# EAGLE design Split-ADA4304-4 (EAGLE 7.5.0)

## Sheet 1 of 2
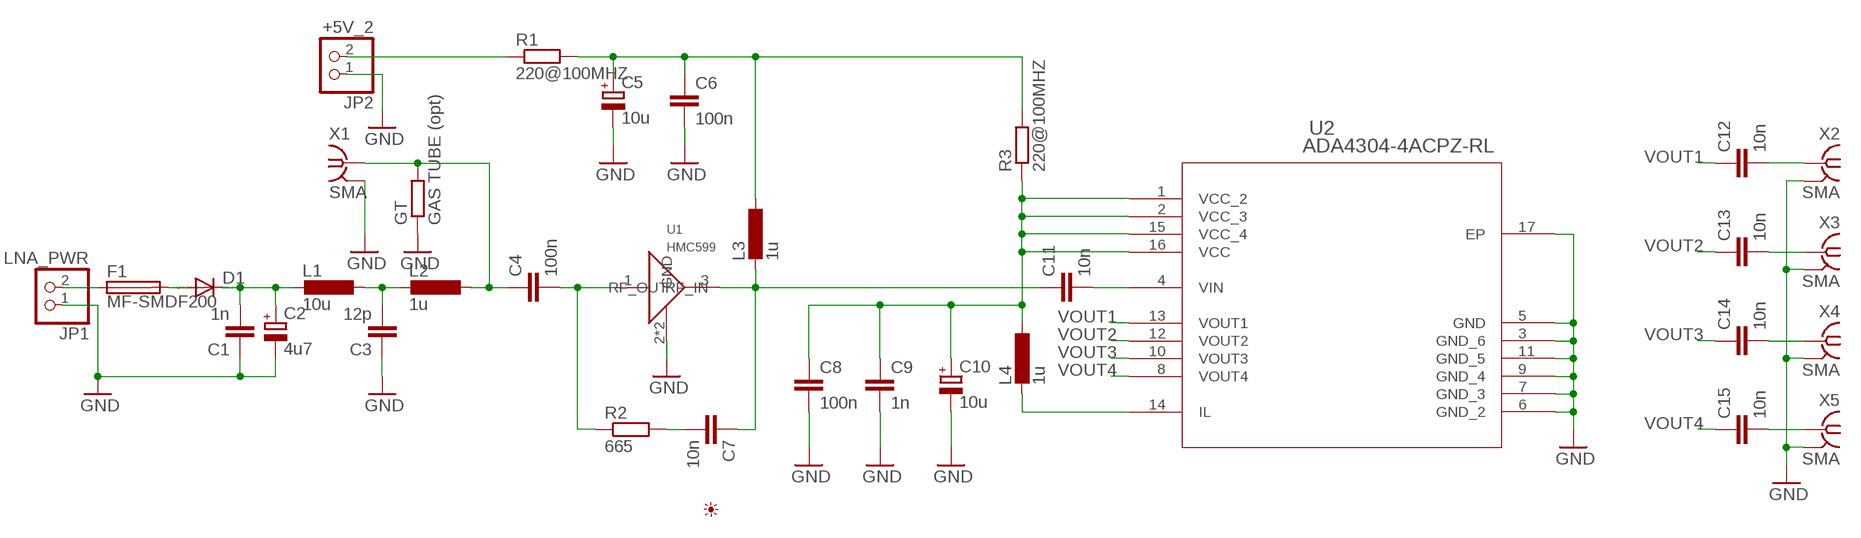
[diagram p0: schematic, sheet 1]

### Parts
C1  1n  C-EUC0603  [C0603]
C2  4u7  CPOL-EUSMCA  [SMC_A]
C3  12p  C-EUC0603  [C0603]
C4  100n  C-EUC0603  [C0603]
C5  10u  CPOL-EUSMCA  [SMC_A]
C6  100n  C-EUC0603  [C0603]
C7  10n  C-EUC0603  [C0603]
C8  100n  C-EUC0603  [C0603]
C9  1n  C-EUC0603  [C0603]
C10  10u  CPOL-EUSMCA  [SMC_A]
C11  10n  C-EUC0603  [C0603]
C12  10n  C-EUC0603  [C0603]
C13  10n  C-EUC0603  [C0603]
C14  10n  C-EUC0603  [C0603]
C15  10n  C-EUC0603  [C0603]
D1  DIODE-MINIMELF  [MINIMELF]
F1  MF-SMDF200  [MF-SMDF050]
GT  GAS TUBE (opt)  R-EU_R0805  [R0805]
JP1  LNA_PWR  PINHD-1X2  [1X02]
JP2  +5V_2  PINHD-1X2  [1X02]
L1  10u  L-EUL2012C  [L2012C]
L2  1u  L-EUL2012C  [L2012C]
L3  1u  L-EUL2012C  [L2012C]
L4  1u  L-EUL2012C  [L2012C]
PICTO1  PICTO_1  [PICTO_1]
R1  220@100MHZ  R-EU_R0805  [R0805]
R2  665  R-EU_R0603  [R0603]
R3  220@100MHZ  R-EU_R0805  [R0805]
U1  HMC599  [SOT89]
U2  ADA4304-4ACPZ-RL  [CP_16_2]
X1  SMA  SMA-142-0701-801/806  [J502-ND-142-0701-801/806]
X2  SMA  SMA-142-0701-801/806  [J502-ND-142-0701-801/806]
X3  SMA  SMA-142-0701-801/806  [J502-ND-142-0701-801/806]
X4  SMA  SMA-142-0701-801/806  [J502-ND-142-0701-801/806]
X5  SMA  SMA-142-0701-801/806  [J502-ND-142-0701-801/806]

### Nets
GND: C1.1 C2.- C3.1 C5.- C6.2 C8.2 C9.2 C10.- GT.1 JP1.1 JP2.1 U1.2(GND) U1.2.1(GND) U2.3(GND_6) U2.5(GND) U2.6(GND_2) U2.7(GND_3) U2.9(GND_4) U2.11(GND_5) U2.17(EP) X1.G@1 X1.G@2 X1.G@3 X1.G@4 X2.G@1 X2.G@2 X2.G@3 X2.G@4 X3.G@1 X3.G@2 X3.G@3 X3.G@4 X4.G@1 X4.G@2 X4.G@3 X4.G@4 X5.G@1 X5.G@2 X5.G@3 X5.G@4 ; also sheet 2
N$1: C8.1 C9.1 C10.+ L4.1 R3.1 U2.1(VCC_2) U2.2(VCC_3) U2.15(VCC_4) U2.16(VCC)
N$2: F1.1 JP1.2
N$3: C12.2 X2.1
N$4: C13.2 X3.1
N$5: C14.2 X4.1
N$6: C4.1 GT.2 L2.1 X1.1
N$7: C11.2 U2.4(VIN)
N$8: L4.2 U2.14(IL)
N$9: C15.2 X5.1
N$17: C5.+ C6.1 L3.1 R1.2 R3.2
N$22: C4.2 R2.1 U1.1(RF_IN)
N$23: JP2.2 R1.1
N$35: C1.2 C2.+ D1.C L1.2
N$41: C3.2 L1.1 L2.2
N$42: D1.A F1.2
N$51: C7.2 R2.2
RF_OUT: C7.1 C11.1 L3.2 U1.3(RF_OUT)
VOUT1: C12.1 U2.13(VOUT1)
VOUT2: C13.1 U2.12(VOUT2)
VOUT3: C14.1 U2.10(VOUT3)
VOUT4: C15.1 U2.8(VOUT4)

## Sheet 2 of 2: USB 2.0 Hub
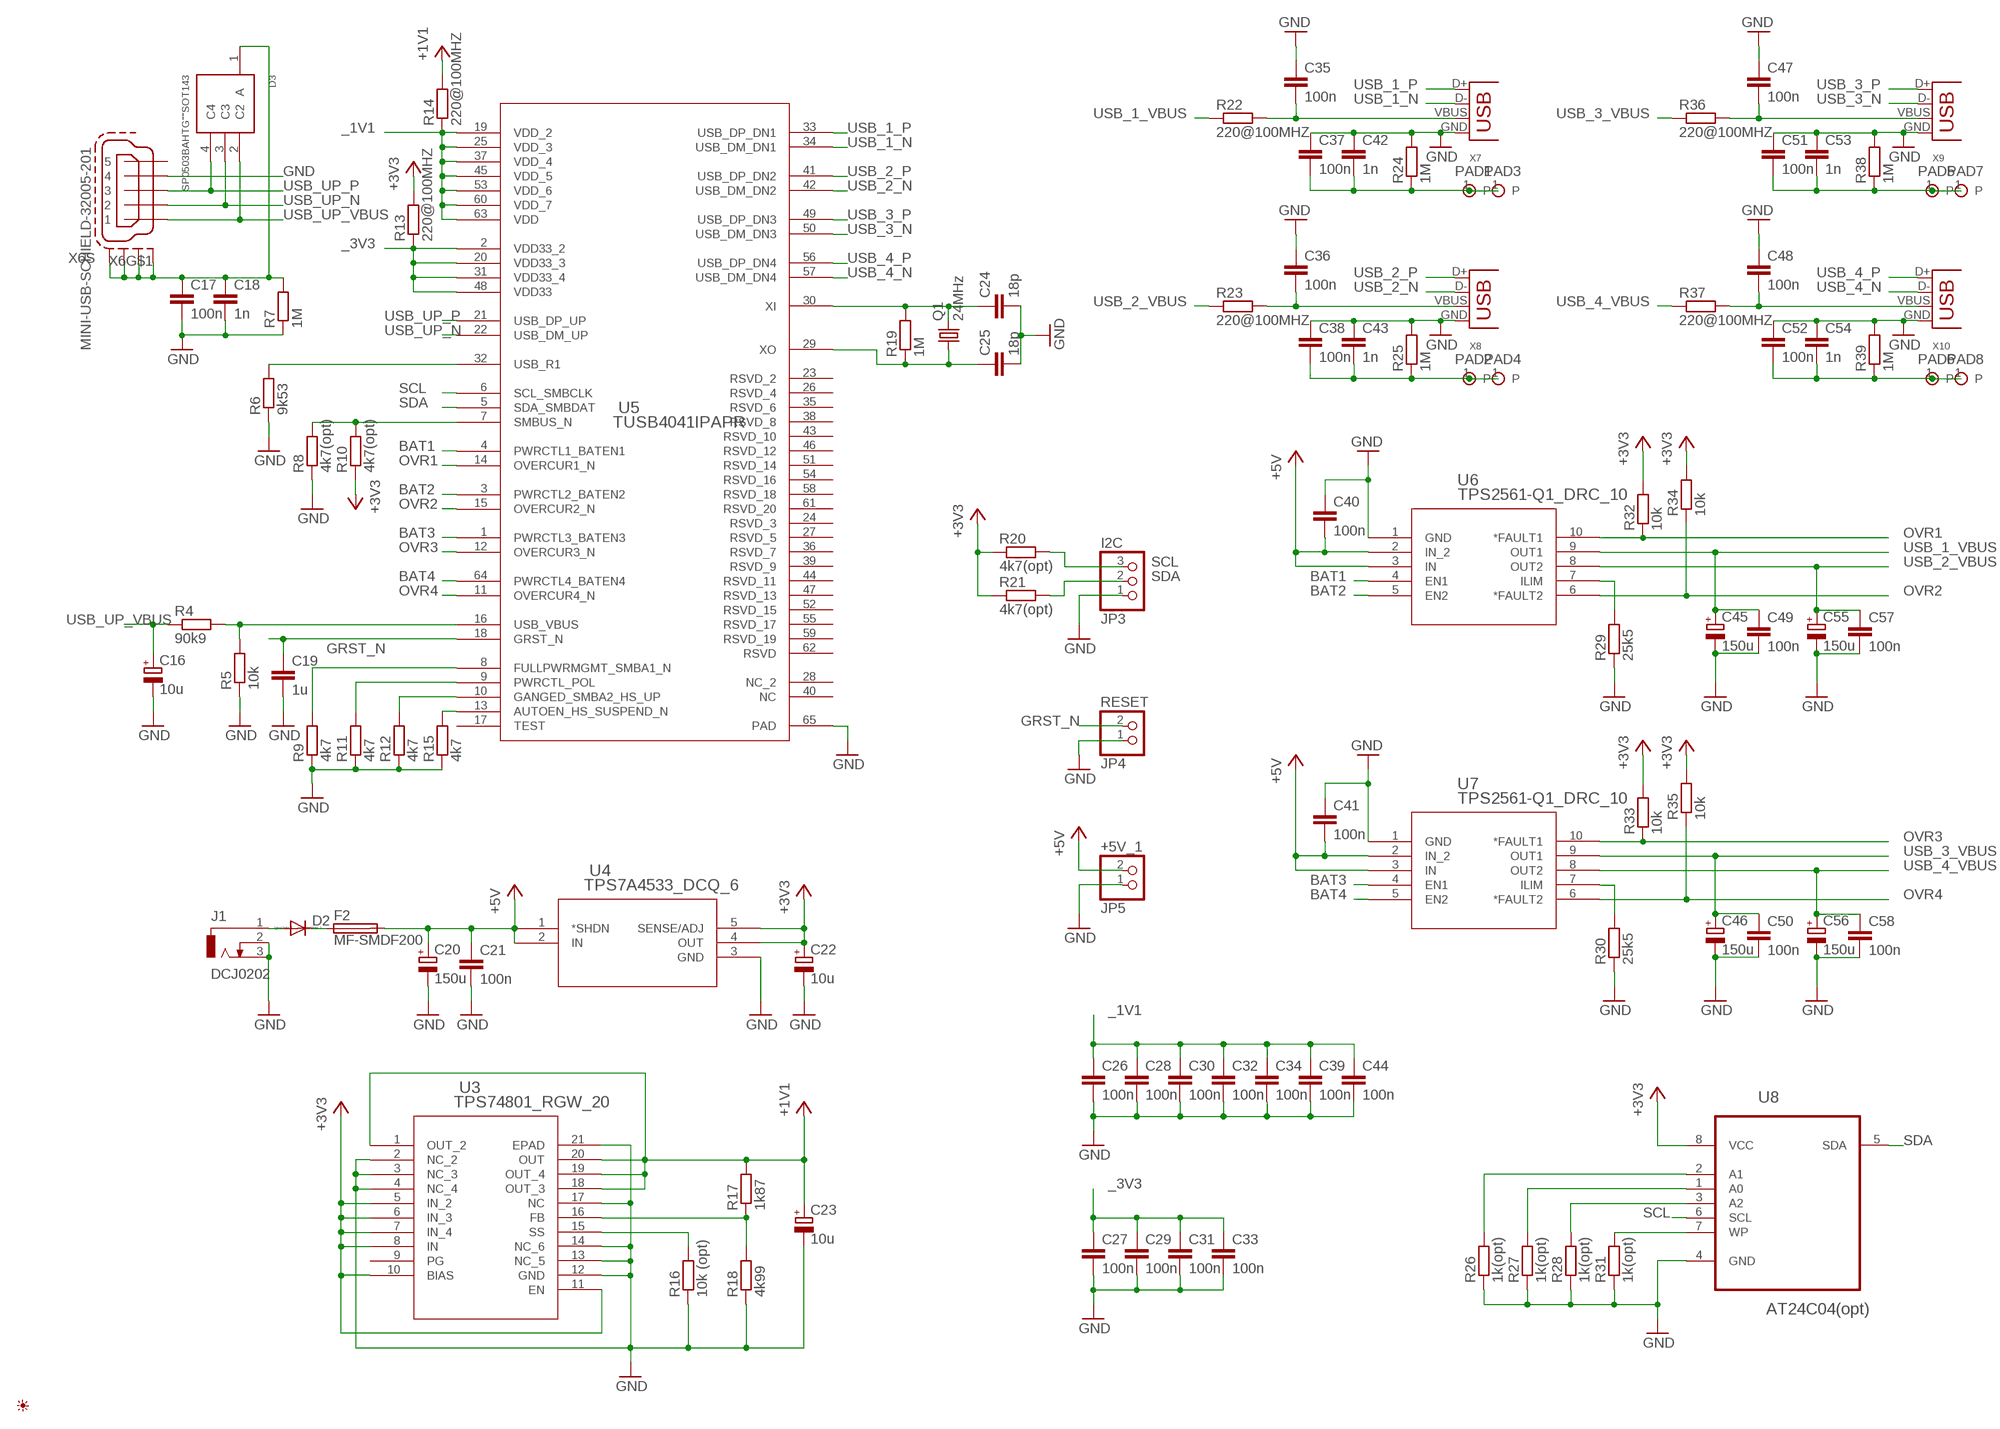
[diagram p1: schematic, sheet 2]

### Parts
C16  10u  CPOL-EUSMCB  [SMC_B]
C17  100n  C-EUC0603  [C0603]
C18  1n  C-EUC0603  [C0603]
C19  1u  C-EUC1206  [C1206]
C20  150u  CPOL-EUE2.5-7  [E2,5-7]
C21  100n  C-EUC0603  [C0603]
C22  10u  CPOL-EUSMCB  [SMC_B]
C23  10u  CPOL-EUSMCB  [SMC_B]
C24  18p  C-EUC0603  [C0603]
C25  18p  C-EUC0603  [C0603]
C26  100n  C-EUC0603  [C0603]
C27  100n  C-EUC0603  [C0603]
C28  100n  C-EUC0603  [C0603]
C29  100n  C-EUC0603  [C0603]
C30  100n  C-EUC0603  [C0603]
C31  100n  C-EUC0603  [C0603]
C32  100n  C-EUC0603  [C0603]
C33  100n  C-EUC0603  [C0603]
C34  100n  C-EUC0603  [C0603]
C35  100n  C-EUC0603  [C0603]
C36  100n  C-EUC0603  [C0603]
C37  100n  C-EUC0603  [C0603]
C38  100n  C-EUC0603  [C0603]
C39  100n  C-EUC0603  [C0603]
C40  100n  C-EUC0603  [C0603]
C41  100n  C-EUC0603  [C0603]
C42  1n  C-EUC0603  [C0603]
C43  1n  C-EUC0603  [C0603]
C44  100n  C-EUC0603  [C0603]
C45  150u  CPOL-EUE2.5-7  [E2,5-7]
C46  150u  CPOL-EUE2.5-7  [E2,5-7]
C47  100n  C-EUC0603  [C0603]
C48  100n  C-EUC0603  [C0603]
C49  100n  C-EUC0603  [C0603]
C50  100n  C-EUC0603  [C0603]
C51  100n  C-EUC0603  [C0603]
C52  100n  C-EUC0603  [C0603]
C53  1n  C-EUC0603  [C0603]
C54  1n  C-EUC0603  [C0603]
C55  150u  CPOL-EUE2.5-7  [E2,5-7]
C56  150u  CPOL-EUE2.5-7  [E2,5-7]
C57  100n  C-EUC0603  [C0603]
C58  100n  C-EUC0603  [C0603]
D2  DIODE-MINIMELF  [MINIMELF]
D3  SP0503BAHTG""SOT143  [SOT143]
F2  MF-SMDF200  [MF-SMDF050]
J1  DCJ0202  [DCJ0202]
JP3  I2C  PINHD-1X3  [1X03]
JP4  RESET  PINHD-1X2  [1X02]
JP5  +5V_1  PINHD-1X2  [1X02]
PAD1  PADPAD1.5  [PAD1.5]
PAD2  PADPAD1.5  [PAD1.5]
PAD3  PADPAD1.5  [PAD1.5]
PAD4  PADPAD1.5  [PAD1.5]
PAD5  PADPAD1.5  [PAD1.5]
PAD6  PADPAD1.5  [PAD1.5]
PAD7  PADPAD1.5  [PAD1.5]
PAD8  PADPAD1.5  [PAD1.5]
PICTO2  PICTO_1  [PICTO_1]
Q1  24MHz  CRYSTALHC49UP  [HC49UP]
R4  90k9  R-EU_R0603  [R0603]
R5  10k  R-EU_R0603  [R0603]
R6  9k53  R-EU_R0603  [R0603]
R7  1M  R-EU_R0603  [R0603]
R8  4k7(opt)  R-EU_R0603  [R0603]
R9  4k7  R-EU_R0603  [R0603]
R10  4k7(opt)  R-EU_R0603  [R0603]
R11  4k7  R-EU_R0603  [R0603]
R12  4k7  R-EU_R0603  [R0603]
R13  220@100MHZ  R-EU_R0805  [R0805]
R14  220@100MHZ  R-EU_R0805  [R0805]
R15  4k7  R-EU_R0603  [R0603]
R16  10k (opt)  R-EU_R0603  [R0603]
R17  1k87  R-EU_R0603  [R0603]
R18  4k99  R-EU_R0603  [R0603]
R19  1M  R-EU_R0603  [R0603]
R20  4k7(opt)  R-EU_R0603  [R0603]
R21  4k7(opt)  R-EU_R0603  [R0603]
R22  220@100MHZ  R-EU_R0805  [R0805]
R23  220@100MHZ  R-EU_R0805  [R0805]
R24  1M  R-EU_R0603  [R0603]
R25  1M  R-EU_R0603  [R0603]
R26  1k(opt)  R-EU_R0603  [R0603]
R27  1k(opt)  R-EU_R0603  [R0603]
R28  1k(opt)  R-EU_R0603  [R0603]
R29  25k5  R-EU_R0603  [R0603]
R30  25k5  R-EU_R0603  [R0603]
R31  1k(opt)  R-EU_R0603  [R0603]
R32  10k  R-EU_R0603  [R0603]
R33  10k  R-EU_R0603  [R0603]
R34  10k  R-EU_R0603  [R0603]
R35  10k  R-EU_R0603  [R0603]
R36  220@100MHZ  R-EU_R0805  [R0805]
R37  220@100MHZ  R-EU_R0805  [R0805]
R38  1M  R-EU_R0603  [R0603]
R39  1M  R-EU_R0603  [R0603]
U3  TPS74801_RGW_20  [RGW20_3P15X3P15]
U4  TPS7A4533_DCQ_6  [DCQ6]
U5  TUSB4041IPAPR  [PAP0064K_N]
U6  TPS2561-Q1_DRC_10  [DRC10_2P4X1P65]
U7  TPS2561-Q1_DRC_10  [DRC10_2P4X1P65]
U8  AT24C04(opt)  AT24C04BN-SH-B  [SOIC127P600X175-8N]
X6  MINI-USB-SCHIELD-32005-201  [32005-201]
X7  USB-A-HU  [USB-A-HU]
X8  USB-A-HU  [USB-A-HU]
X9  USB-A-HU  [USB-A-HU]
X10  USB-A-HU  [USB-A-HU]

### Nets
+3V3: C22.+ R10.1 R13.2 R20.1 R21.1 R32.2 R33.2 R34.2 R35.2 U3.5(IN_2) U3.6(IN_3) U3.7(IN_4) U3.8(IN) U3.10(BIAS) U3.11(EN) U4.4(OUT) U4.5(SENSE/ADJ) U8.8(VCC)
+5V: C20.+ C21.1 C40.2 C41.2 F2.2 JP5.2 U4.1(*SHDN) U4.2(IN) U6.2(IN_2) U6.3(IN) U7.2(IN_2) U7.3(IN)
_1V1: C26.1 C28.1 C30.1 C32.1 C34.1 C39.1 C44.1 R14.1 U5.19(VDD_2) U5.25(VDD_3) U5.37(VDD_4) U5.45(VDD_5) U5.53(VDD_6) U5.60(VDD_7) U5.63(VDD)
_3V3: C27.1 C29.1 C31.1 C33.1 R13.1 U5.2(VDD33_2) U5.20(VDD33_3) U5.31(VDD33_4) U5.48(VDD33)
BAT1: U5.4(PWRCTL1_BATEN1) U6.4(EN1)
BAT2: U5.3(PWRCTL2_BATEN2) U6.5(EN2)
BAT3: U5.1(PWRCTL3_BATEN3) U7.4(EN1)
BAT4: U5.64(PWRCTL4_BATEN4) U7.5(EN2)
GND: C16.- C17.2 C18.2 C19.2 C20.- C21.2 C22.- C23.- C24.2 C25.2 C26.2 C27.2 C28.2 C29.2 C30.2 C31.2 C32.2 C33.2 C34.2 C35.1 C36.1 C37.1 C38.1 C39.2 C40.1 C41.1 C42.1 C43.1 C44.2 C45.- C46.- C47.1 C48.1 C49.2 C50.2 C51.1 C52.1 C53.1 C54.1 C55.- C56.- C57.2 C58.2 J1.2 J1.3 JP3.1 JP4.1 JP5.1 R5.1 R6.1 R7.1 R8.1 R9.1 R11.1 R12.1 R15.1 R16.1 R18.1 R24.2 R25.2 R26.1 R27.1 R28.1 R29.1 R30.1 R31.1 R38.2 R39.2 U3.2(NC_2) U3.3(NC_3) U3.4(NC_4) U3.12(GND) U3.13(NC_5) U3.14(NC_6) U3.17(NC) U3.21(EPAD) U4.3(GND) U5.65(PAD) U6.1(GND) U7.1(GND) U8.4(GND) X6.4 X7.GND X8.GND X9.GND X10.GND ; also sheet 1
GRST_N: C19.1 JP4.2 U5.18(GRST_N)
N$10: C24.1 Q1.2 R19.2 U5.30(XI)
N$11: C25.1 Q1.1 R19.1 U5.29(XO)
N$12: R4.2 R5.2 U5.16(USB_VBUS)
N$13: R6.2 U5.32(USB_R1)
N$14: R11.2 U5.9(PWRCTL_POL)
N$15: R9.2 U5.8(FULLPWRMGMT_SMBA1_N)
N$16: R8.2 R10.2 U5.7(SMBUS_N)
N$18: R12.2 U5.10(GANGED_SMBA2_HS_UP)
N$19: R15.2 U5.13(AUTOEN_HS_SUSPEND_N)
N$20: C37.2 C42.2 PAD1.1(P) PAD3.1(P) R24.1
N$24: C35.2 R22.2 X7.VBUS
N$25: C38.2 C43.2 PAD2.1(P) PAD4.1(P) R25.1
N$26: C36.2 R23.2 X8.VBUS
N$27: C51.2 C53.2 PAD5.1(P) PAD7.1(P) R38.1
N$28: C47.2 R36.2 X9.VBUS
N$29: C52.2 C54.2 PAD6.1(P) PAD8.1(P) R39.1
N$30: C48.2 R37.2 X10.VBUS
N$31: R17.1 R18.2 U3.16(FB)
N$32: R16.2 U3.15(SS)
N$33: D2.A J1.1
N$34: R29.2 U6.7(ILIM)
N$36: R30.2 U7.7(ILIM)
N$37: R31.2 U8.7(WP)
N$38: R28.2 U8.3(A2)
N$39: R27.2 U8.1(A0)
N$40: R26.2 U8.2(A1)
N$43: D2.C F2.1
N$44: C17.1 C18.1 D3.1(A) R7.2 X6.M1(S:S1) X6.M2(S:S2) X6.M3(S:S3) X6.M4(S:S4)
OVR1: R32.1 U5.14(OVERCUR1_N) U6.10(*FAULT1)
OVR2: R34.1 U5.15(OVERCUR2_N) U6.6(*FAULT2)
OVR3: R33.1 U5.12(OVERCUR3_N) U7.10(*FAULT1)
OVR4: R35.1 U5.11(OVERCUR4_N) U7.6(*FAULT2)
SCL: JP3.3 R20.2 U5.6(SCL_SMBCLK) U8.6(SCL)
SDA: JP3.2 R21.2 U5.5(SDA_SMBDAT) U8.5(SDA)
USB_1_N: U5.34(USB_DM_DN1) X7.D-
USB_1_P: U5.33(USB_DP_DN1) X7.D+
USB_1_VBUS: C45.+ C49.1 R22.1 U6.9(OUT1)
USB_2_N: U5.42(USB_DM_DN2) X8.D-
USB_2_P: U5.41(USB_DP_DN2) X8.D+
USB_2_VBUS: C55.+ C57.1 R23.1 U6.8(OUT2)
USB_3_N: U5.50(USB_DM_DN3) X9.D-
USB_3_P: U5.49(USB_DP_DN3) X9.D+
USB_3_VBUS: C46.+ C50.1 R36.1 U7.9(OUT1)
USB_4_N: U5.57(USB_DM_DN4) X10.D-
USB_4_P: U5.56(USB_DP_DN4) X10.D+
USB_4_VBUS: C56.+ C58.1 R37.1 U7.8(OUT2)
USB_UP_N: D3.3(C3) U5.22(USB_DM_UP) X6.2
USB_UP_P: D3.4(C4) U5.21(USB_DP_UP) X6.3
USB_UP_VBUS: C16.+ D3.2(C2) R4.1 X6.1
VCC: C23.+ R14.2 R17.2 U3.1(OUT_2) U3.18(OUT_3) U3.19(OUT_4) U3.20(OUT) ; supply symbol labelled +1V1
Unconnected: U3.9(PG) U5.17(TEST) U5.23(RSVD_2) U5.24(RSVD_3) U5.26(RSVD_4) U5.27(RSVD_5) U5.28(NC_2) U5.35(RSVD_6) U5.36(RSVD_7) U5.38(RSVD_8) U5.39(RSVD_9) U5.40(NC) U5.43(RSVD_10) U5.44(RSVD_11) U5.46(RSVD_12) U5.47(RSVD_13) U5.51(RSVD_14) U5.52(RSVD_15) U5.54(RSVD_16) U5.55(RSVD_17) U5.58(RSVD_18) U5.59(RSVD_19) U5.61(RSVD_20) U5.62(RSVD) X6.5

## Library data of the parts
C1 C3 C4 C6-C9 C11-C15 C17-C19 C21 C24-C44 C47-C54 C57 C58 = rcl:C-EU: CAPACITOR, European symbol
C2 C5 C10 C16 C20 C22 C23 C45 C46 C55 C56 = rcl:CPOL-EU: POLARIZED CAPACITOR, European symbol
D1 D2 = diode:DIODE-: DIODE
D3 = Littelfuse:SP0503BAHTG: Littelfuse SP0503BAHTG TVS DIODE 5.5VWM 8.5VC SOT143
F1 F2 = fuse:MF-SMDF: MF-SMDF Series - PRC Resettable Fuses Source: http://www.farnell.com/datasheets/716597.pdf
GT R1-R39 = rcl:R-EU_: RESISTOR, European symbol
J1 = con-jack:DCJ0202: DC POWER JACK Source: DCJ0202.pdf; OC_FARNELL: unknown; OC_NEWARK: unknown
JP1 JP2 JP4 JP5 = pinhead:PINHD-1X2: PIN HEADER
JP3 = pinhead:PINHD-1X3: PIN HEADER
L1-L4 = rcl:L-EU: INDUCTOR, European symbol
PAD1-PAD8 = interconnect:PAD
PICTO1 PICTO2 = My_Picto:PICTO_1: Zdenek Brichacek; OK3ZB; http://blog.brichacek.net
Q1 = crystal:CRYSTAL: CRYSTAL; OC_FARNELL: unknown; OC_NEWARK: unknown
U1 = Hittite:HMC599: AD (Hittite) HMC599
U2 = Analog Devices:ADA4304-4ACPZ-RL
U3 = Texas Instruments:TPS74801_RGW_20; DATASHEETURL: http://www.ti.com/lit/gpn/TPS74801; DESCRIPTION: Single Output LDO, 1.5A, Adj. (0.8 to 3.6V), Programmable Soft-Start; FAMILY_NAME: SINGLE CHANNEL LDO; GENERIC_PART_NUMBER: TPS74801; INDUSTRY_STD_PKG_TYPE: VQFN; MANUFACTURER: Texas Instruments; MANUFACTURER_PART_NUMBER: tps74801_rgw_20; PACKAGE_DESIGNATOR: RGW; PIN_COUNT: 20; VENDOR: Texas Instruments
U4 = Texas Instruments:TPS7A4533_DCQ_6; DATASHEETURL: http://www.ti.com/lit/gpn/TPS7A4533; DESCRIPTION: Low-Noise Fast-Transient-Response 1.5-A LDO Regulator; FAMILY_NAME: SINGLE CHANNEL LDO; GENERIC_PART_NUMBER: TPS7A4533; INDUSTRY_STD_PKG_TYPE: SOT-223; MANUFACTURER: Texas Instruments; MANUFACTURER_PART_NUMBER: tps7a4533_dcq_6; PACKAGE_DESIGNATOR: DCQ; PIN_COUNT: 6; VENDOR: Texas Instruments
U5 = Texas Instruments:TUSB4041IPAPR; ALTERNATEPARTNUMBER: TUSB4041IPAP; APPLICATION_BUILDNUMBER: *; COMPTYPE: IC; MANUFACTURER: Texas Instruments; MOUNTTYPE: SMT; PACKAGEREFERENCE: PAP0064K; PARTNUMBER: TUSB4041IPAPR; PIN_COUNT: 65; REFDES: RefDes; ROHS: Y; TYPE: TYPE; VALUE: Value
U6 U7 = Texas Instruments:TPS2561-Q1_DRC_10; DATASHEETURL: http://www.ti.com/lit/gpn/TPS2561-Q1; DESCRIPTION: Automotive Catalog Dual Channel Precision Adjustable Current-Limited Power Switches; FAMILY_NAME: USB POWER SWITCH; GENERIC_PART_NUMBER: TPS2561-Q1; INDUSTRY_STD_PKG_TYPE: SON; MANUFACTURER: Texas Instruments; MANUFACTURER_PART_NUMBER: tps2561-q1_drc_10; PACKAGE_DESIGNATOR: DRC; PIN_COUNT: 10; VENDOR: Texas Instruments
U8 = Atmel_By_element14_Batch_1-00:AT24C04BN-SH-B: Two-wire Serial EEPROM; MPN: AT24C04BN-SH-B; OC_FARNELL: 1362643; OC_NEWARK: 50M3316; PACKAGE: SOIC-8; SUPPLIER: Atmel
X1-X5 = con-coax:SMA-: SMA 50 Ohm End Launch Jack Receptacle - Round Contact Johnson Components Source: www.johnsoncomponents.com .. J502-ND.pdf; MF: JOHNSON COMPONENTS; MPN: 142-0701-801; OC_FARNELL: 1608592; OC_NEWARK: 90F2624
X6 = con-cypressindustries:MINI-USB-SCHIELD-: MINI USB-B Conector Source: www.cypressindustries.com; OC_FARNELL: unknown; OC_NEWARK: unknown
X7-X10 = con-usb-3:USB: USB Connectors

## Net classes
1 RF: width 2.5 mm, clearance 0.508 mm

## Board
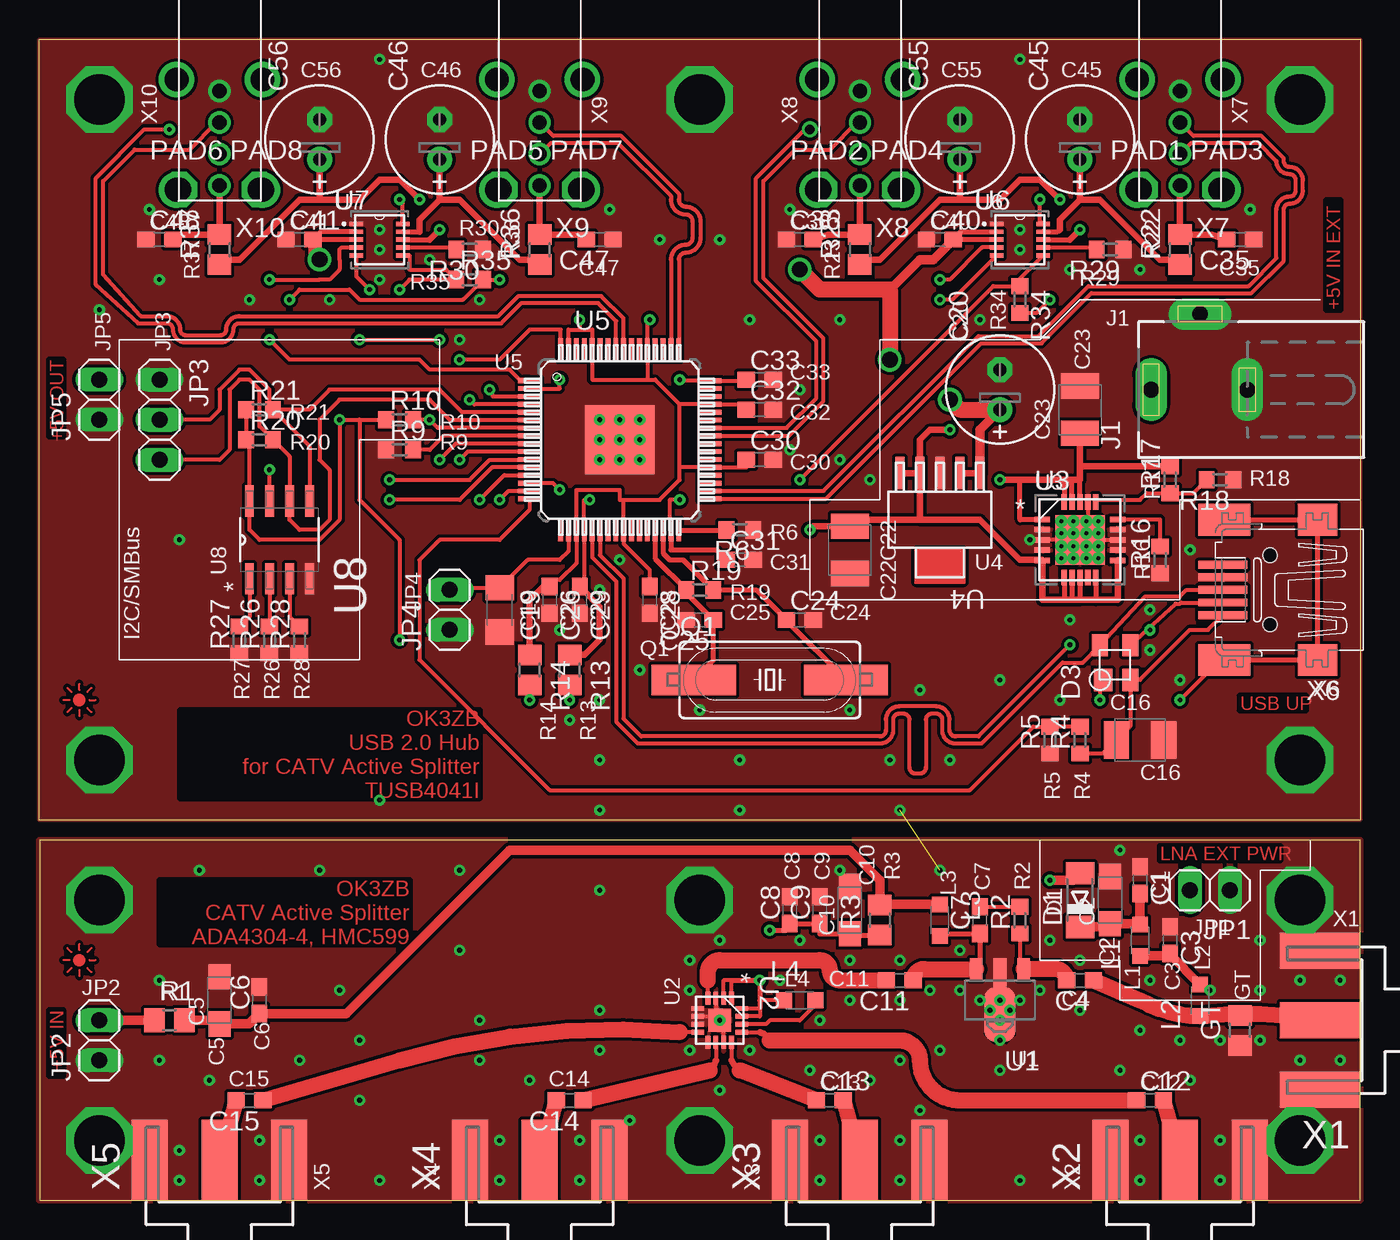
[diagram p2: board, top side]
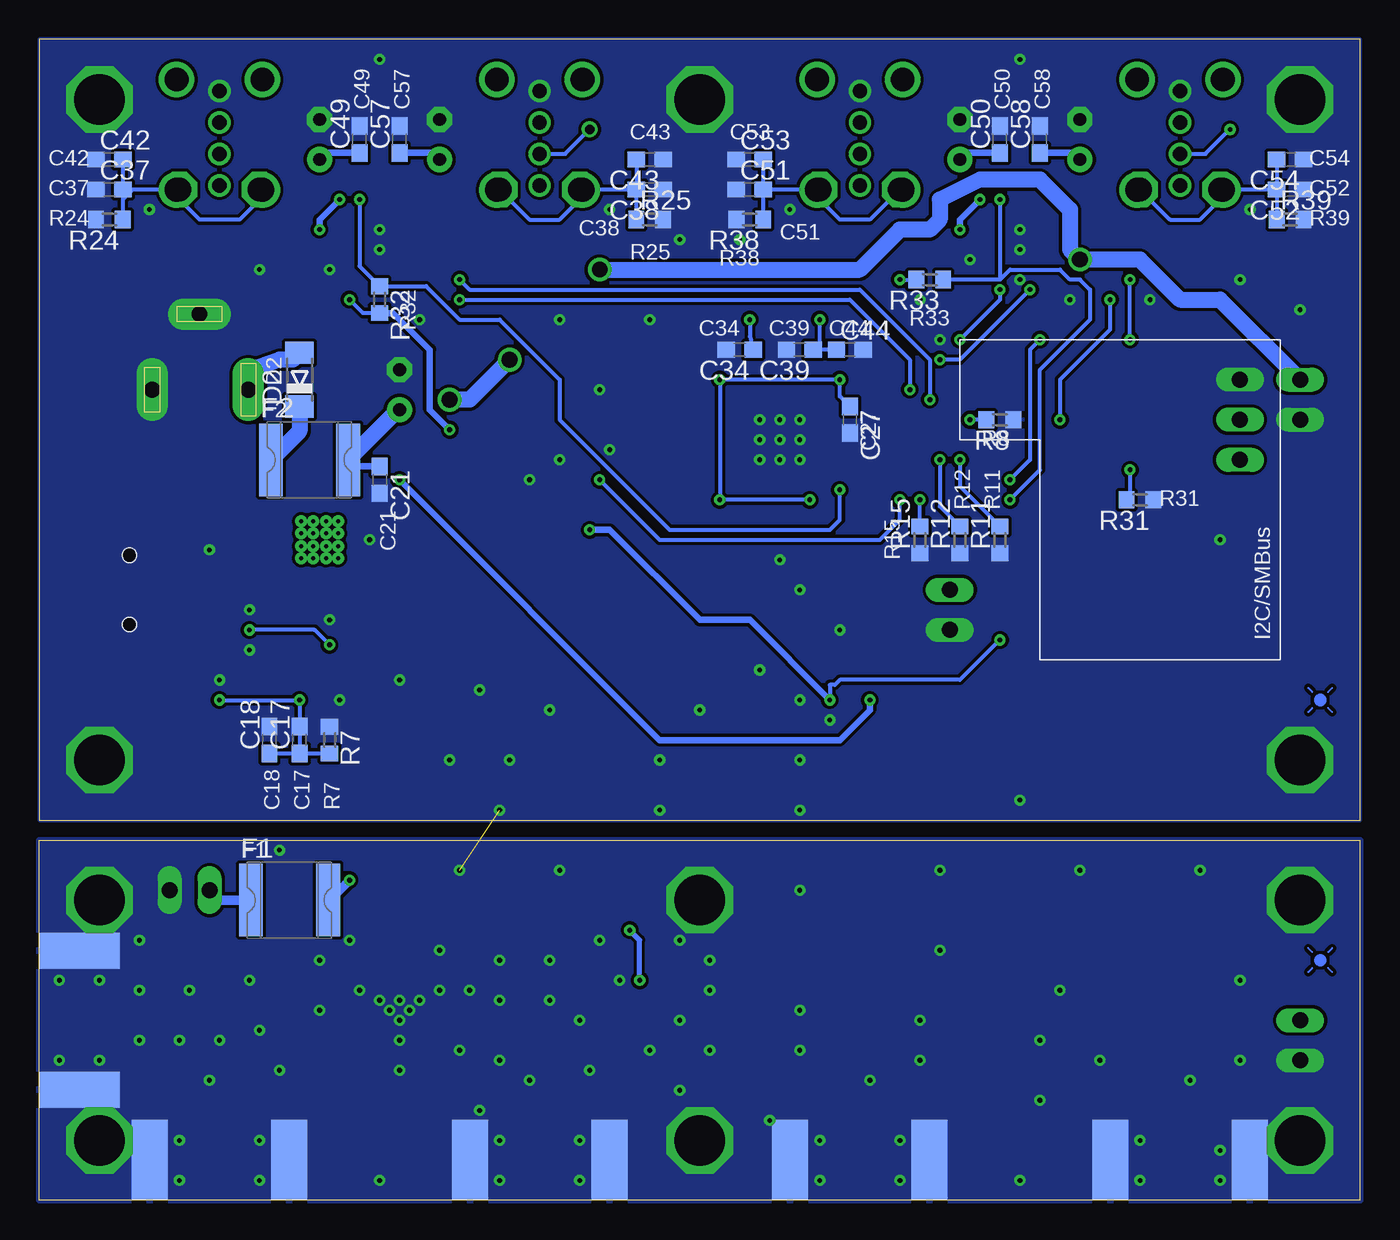
[diagram p3: board, bottom side, seen from below]

Size 83.82 x 73.66 mm. Coordinates in mm from the lower left corner, seen from the top.
Outline: 83.82,22.86 0.02,22.86 0.02,0 83.82,0 83.82,22.86
Outline: 0,73.66 83.82,73.66 83.82,24.13 0,24.13 0,73.66
Copper layers (1*16): Top 0.035mm / dielectric 1.5mm / Bottom 0.035mm
Design rules "default *": minimum track width 10mil, minimum drill 20mil, track to track 8mil, track to pad 8mil, pad to pad 8mil, via to via 8mil, smd to smd 8mil, copper to edge 0mil, drill to drill 8mil, minimum pad ring 10mil, minimum via ring 8mil, stop-mask expansion 4mil, vias tented up to drill 0mil, thermal gap 0mil

### Footprints (pad centres in the part's own frame; a part is rotated, then mirrored left to right if it is on the bottom)
C0603 = smd 1.1 x 1: 1 -0.85,0; 2 0.85,0
SMC_A = smd 1.6 x 1.4: + -1.5,0; - 1.5,0
SMC_B = smd 1.6 x 2.4: + -1.5,0; - 1.5,0
C1206 = smd 1.6 x 1.8: 1 -1.4,0; 2 1.4,0
E2,5-7 = drill 0.813 pad 1.6: + -1.27,0 | drill 0.813 pad 1.6 octagon: - 1.27,0
MINIMELF = smd 1.4 x 1.8: A 1.7,0; C -1.7,0
SOT143 = smd 1.2 x 1.4: 1 -1.07,-1.27 | smd 1 x 1.4: 2 0.65,-1.27; 3 0.65,0.93; 4 -1.27,0.93
MF-SMDF050 = smd 1.5 x 4.6: 1 -2.45,0; 2 2.45,0
R0805 = smd 1.3 x 1.5: 1 -0.95,0; 2 0.95,0
DCJ0202 = drill 1 pad 2 long: 1 0,3.1; 2 4.8,0; 3 0,-3
1X02 = drill 1.016 long: 1 -1.27,0; 2 1.27,0
1X03 = drill 1.016 long: 1 -2.54,0; 2 0,0; 3 2.54,0
L2012C = smd 1 x 1: 1 -1,0; 2 1,0
PAD1.5 = drill 1.5 octagon: 1 0,0
HC49UP = smd 5.334 x 1.93: 1 -4.826,0; 2 4.826,0
R0603 = smd 1 x 1.1: 1 -0.85,0; 2 0.85,0
SOT89 = smd 0.8 x 1.4: 1 -1.499,-1.981; 3 1.499,-1.981 | smd 0.8 x 1.9: 2 0,-1.727 | smd 2 x 3.5: 2.1 0,0.889
CP_16_2 = smd 0.813 x 0.305: 1 -1.397,0.75; 2 -1.397,0.25; 3 -1.397,-0.25; 4 -1.397,-0.75; 9 1.397,-0.75; 10 1.397,-0.25; 11 1.397,0.25; 12 1.397,0.75 | smd 0.305 x 0.813: 5 -0.75,-1.397; 6 -0.25,-1.397; 7 0.25,-1.397; 8 0.75,-1.397; 13 0.75,1.397; 14 0.25,1.397; 15 -0.25,1.397; 16 -0.75,1.397 | smd 1.448 x 1.448: 17 0,0
RGW20_3P15X3P15 = smd 0.991 x 0.356: 1 -2.4,1.3; 2 -2.4,0.65; 3 -2.4,0; 4 -2.4,-0.65; 5 -2.4,-1.3; 11 2.4,-1.3; 12 2.4,-0.65; 13 2.4,0; 14 2.4,0.65; 15 2.4,1.3 | smd 0.356 x 0.991: 6 -1,-2.4; 7 -0.5,-2.4; 8 0,-2.4; 9 0.5,-2.4; 10 1,-2.4; 16 1,2.4; 17 0.5,2.4; 18 0,2.4; 19 -0.5,2.4; 20 -1,2.4 | smd 3.15 x 3.15: 21 0,0 | drill 0.254: V -1.168,-1.168; V_1 -1.168,-0.406; V_2 -1.168,0.406; V_3 -1.168,1.168; V_4 -0.406,-1.168; V_5 -0.406,-0.406; V_6 -0.406,0.406; V_7 -0.406,1.168; V_8 0.406,-1.168; V_9 0.406,-0.406; V_10 0.406,0.406; V_11 0.406,1.168; V_12 1.168,-1.168; V_13 1.168,-0.406; V_14 1.168,0.406; V_15 1.168,1.168
DCQ6 = smd 0.559 x 2.057: 1 -2.54,-2.959; 2 -1.27,-2.959; 3 0,-2.959; 4 1.27,-2.959; 5 2.54,-2.959
PAP0064K_N = smd 1.448 x 0.305: 1 -5.725,3.75; 2 -5.725,3.25; 3 -5.725,2.75; 4 -5.725,2.25; 5 -5.725,1.75; 6 -5.725,1.25; 7 -5.725,0.75; 8 -5.725,0.25; 9 -5.725,-0.25; 10 -5.725,-0.75; 11 -5.725,-1.25; 12 -5.725,-1.75; 13 -5.725,-2.25; 14 -5.725,-2.75; 15 -5.725,-3.25; 16 -5.725,-3.75; 33 5.725,-3.75; 34 5.725,-3.25; 35 5.725,-2.75; 36 5.725,-2.25; 37 5.725,-1.75; 38 5.725,-1.25; 39 5.725,-0.75; 40 5.725,-0.25; 41 5.725,0.25; 42 5.725,0.75; 43 5.725,1.25; 44 5.725,1.75; 45 5.725,2.25; 46 5.725,2.75; 47 5.725,3.25; 48 5.725,3.75 | smd 0.305 x 1.448: 17 -3.75,-5.725; 18 -3.25,-5.725; 19 -2.75,-5.725; 20 -2.25,-5.725; 21 -1.75,-5.725; 22 -1.25,-5.725; 23 -0.75,-5.725; 24 -0.25,-5.725; 25 0.25,-5.725; 26 0.75,-5.725; 27 1.25,-5.725; 28 1.75,-5.725; 29 2.25,-5.725; 30 2.75,-5.725; 31 3.25,-5.725; 32 3.75,-5.725; 49 3.75,5.725; 50 3.25,5.725; 51 2.75,5.725; 52 2.25,5.725; 53 1.75,5.725; 54 1.25,5.725; 55 0.75,5.725; 56 0.25,5.725; 57 -0.25,5.725; 58 -0.75,5.725; 59 -1.25,5.725; 60 -1.75,5.725; 61 -2.25,5.725; 62 -2.75,5.725; 63 -3.25,5.725; 64 -3.75,5.725 | smd 4.394 x 4.394: 65 0,0 | smd 0.508 x 0.508: V 0.65,0.65
DRC10_2P4X1P65 = smd 0.838 x 0.279: 1 -1.475,1; 2 -1.475,0.5; 3 -1.475,0; 4 -1.475,-0.5; 5 -1.475,-1; 6 1.475,-1; 7 1.475,-0.5; 8 1.475,0; 9 1.475,0.5; 10 1.475,1
SOIC127P600X175-8N = smd 1.981 x 0.559: 1 -2.464,1.905; 2 -2.464,0.635; 3 -2.464,-0.635; 4 -2.464,-1.905; 5 2.464,-1.905; 6 2.464,-0.635; 7 2.464,0.635; 8 2.464,1.905
J502-ND-142-0701-801/806 = smd 5.08 x 2.286: 1 2.565,0; G@1 2.565,4.42; G@2 2.565,-4.42 | smd 5.08 x 2.286 bottom: G@3 2.565,4.42; G@4 2.565,-4.42
32005-201 = smd 3.1 x 0.5: 1 3,1.6; 2 3,0.8; 3 3,0; 4 3,-0.8; 5 3,-1.6 | smd 2.5 x 2: M1 -3,-4.45; M2 -3,4.45 | smd 3.3 x 2: M3 2.9,4.45; M4 2.9,-4.45 | hole 0.9: 0,2.2; 0,-2.2
USB-A-HU = drill 0.9: D+ 2.73,0; D- 4.73,0; GND 0.73,0; VBUS 6.73,0 | drill 1.5: P$5 0,2.72; P$6 0,-2.72; P$7 7,2.72; P$8 7,-2.72

### Placement (x,y rotation side)
C1  69.85,20.32 270 top
C2  67.94,19.05 90 top
C3  71.75,16.51 270 top
C4  66.04,13.97 180 top
C5  11.43,12.7 90 top
C6  13.97,12.7 90 top
C7  59.69,17.78 90 top
C8  47.62,18.41 90 top
C9  49.53,18.41 90 top
C10  51.44,18.41 90 top
C11  54.61,13.97 180 top
C12  70.48,6.35 0 top
C13  50.16,6.35 0 top
C14  33.66,6.35 180 top
C15  13.34,6.35 180 top
C16  69.85,29.21 0 top
C17  67.31,29.21 90 bottom
C18  69.22,29.21 90 bottom
C19  29.21,37.47 270 top
C20  60.96,51.44 90 top
C21  62.23,45.72 270 bottom
C22  51.44,41.27 270 top
C23  66.04,50.16 90 top
C24  48.26,36.83 0 top
C25  41.91,36.83 180 top
C26  32.38,38.1 270 top
C27  32.38,49.53 270 bottom
C28  38.73,38.1 270 top
C29  34.29,38.1 270 top
C30  45.72,46.99 0 top
C31  44.45,40.64 0 top
C32  45.72,50.16 0 top
C33  45.72,52.07 0 top
C34  39.37,53.98 180 bottom
C35  76.2,60.96 180 top
C36  48.26,60.96 0 top
C37  79.38,64.14 0 bottom
C38  45.09,64.14 180 bottom
C39  35.56,53.98 180 bottom
C40  57.15,60.96 0 top
C41  16.51,60.96 0 top
C42  79.38,66.04 0 bottom
C43  45.09,66.04 180 bottom
C44  32.38,53.98 0 bottom
C45  66.04,67.31 90 top
C46  25.4,67.31 90 top
C47  35.56,60.96 180 top
C48  7.62,60.96 0 top
C49  63.5,67.31 90 bottom
C50  22.86,67.31 90 bottom
C51  38.73,64.14 0 bottom
C52  4.45,64.14 180 bottom
C53  38.73,66.04 0 bottom
C54  4.45,66.04 180 bottom
C55  58.42,67.31 90 top
C56  17.78,67.31 90 top
C57  60.96,67.31 90 bottom
C58  20.32,67.31 90 bottom
D1  66.04,19.05 90 top
D2  67.31,52.07 90 bottom
D3  68.58,34.29 0 top
F1  67.94,19.05 0 bottom
F2  66.67,46.99 0 bottom
GT  76.2,10.79 90 top
J1  73.66,51.44 90 top
JP1  74.3,19.68 180 top
JP2  3.81,10.16 90 top
JP3  7.62,49.53 270 top
JP4  26.04,37.47 90 top
JP5  3.81,50.8 90 top
L1  69.85,16.51 90 top
L2  73.66,12.7 90 top
L3  57.15,17.78 270 top
L4  48.26,12.7 0 top
PAD1  69.85,64.14 0 top
PAD2  49.53,64.14 0 top
PAD3  74.93,64.14 0 top
PAD4  54.61,64.14 0 top
PAD5  29.21,64.14 0 top
PAD6  8.89,64.14 0 top
PAD7  34.29,64.14 0 top
PAD8  13.97,64.14 0 top
PICTO1  2.54,15.24 180 top
PICTO2  2.54,31.75 0 top
Q1  46.35,33.02 0 top
R1  8.26,11.43 0 top
R2  62.23,17.78 90 top
R3  53.34,17.78 90 top
R4  66.04,29.21 90 top
R5  64.14,29.21 90 top
R6  44.45,42.55 180 top
R7  65.41,29.21 270 bottom
R8  22.86,49.53 180 bottom
R9  22.86,47.62 0 top
R10  22.86,49.53 0 top
R11  22.86,41.91 90 bottom
R12  25.4,41.91 90 bottom
R13  33.66,33.66 270 top
R14  31.11,33.66 270 top
R15  27.94,41.91 90 bottom
R16  71.12,40.64 90 top
R17  71.75,45.72 90 top
R18  74.93,45.72 180 top
R19  41.91,38.73 0 top
R20  13.97,48.26 0 top
R21  13.97,50.16 0 top
R22  72.39,60.33 90 top
R23  52.07,60.33 90 top
R24  79.38,62.23 180 bottom
R25  45.09,62.23 0 bottom
R26  14.61,35.56 90 top
R27  12.7,35.56 90 top
R28  16.51,35.56 90 top
R29  67.94,60.33 180 top
R30  27.3,60.33 180 top
R31  13.97,44.45 180 bottom
R32  62.23,57.15 270 bottom
R33  27.3,58.42 180 bottom
R34  62.23,57.15 270 top
R35  27.3,58.42 0 top
R36  31.75,60.33 90 top
R37  11.43,60.33 90 top
R38  38.73,62.23 180 bottom
R39  4.45,62.23 0 bottom
U1  60.96,12.7 180 top
U2  43.18,11.43 270 top
U3  66.04,41.91 0 top
U4  57.15,43.18 180 top
U5  36.83,48.26 0 top
U6  62.23,60.96 0 top
U7  21.59,60.96 0 top
U8  15.24,41.91 90 top
X1  83.82,11.43 180 top
X2  72.39,0 90 top
X3  52.07,0 90 top
X4  31.75,0 90 top
X5  11.43,0 90 top
X6  78.11,38.73 180 top
X7  72.39,71.12 270 top
X8  52.07,71.12 270 top
X9  31.75,71.12 270 top
X10  11.43,71.12 270 top

### Tracks (layer width: path | path; a pad name or v marks a point on that pad's centre or on a via)
+3V3  (via drill 0.3)
  Top 0.254: v29.21,58.42 R35.2 26.89,57.15 20.32,57.15 19.68,57.78 16.51,57.78 v15.88,57.15 | 20.32,49.53 20.32,44.45 22.86,41.91 v22.86,35.56 | R21.1 R20.1 13.34,48.05 U8.8 13.34,42.55 13.97,41.91 17.78,41.91 19.05,43.18 v19.05,49.53 20.32,49.53 | v64.14,57.15 63.28,56.3 R34.2 | 20.32,49.53 R10.1
  Top 0.305: U3.10 67.04,38.1 | U3.8 66.04,38.1 | U3.6 65.04,38.1 | U3.7 65.54,38.1
  Top 0.406: U4.5 U4.4 | U3.11 68.44,38.1 67.04,38.1 66.04,38.1 65.54,38.1 65.04,38.1 63.64,38.1 U3.5 63.61,40.64 62.23,40.64 59.69,43.18 55.88,43.18 | U4.4 55.88,43.18 | R13.2 v33.66,31.75 | U4.4 55.88,48.26 56.52,48.9 v57.78,48.9 | 55.88,43.18 51.44,43.18 C22.+ 49.12,42.77 v48.9,42.55
  Bottom 0.254: v29.21,58.42 R35.2 | v22.86,35.56 25.4,33.02 33.02,33.02 33.34,32.7 R13.2 v33.66,31.75 | R34.2 63.28,56.3 v64.14,57.15 | v15.88,57.15 15.88,55.24 19.05,52.07 v19.05,49.53
  Bottom 0.406: v57.78,48.9 59.05,50.16 59.05,53.98 61.38,56.3 R34.2 | v48.9,42.55 47.62,42.55 41.91,36.83 38.73,36.83 v33.66,31.75
+5V  (via drill 1)
  Top 0.305: U6.3 C40.2 58.5,61.46 U6.2 | U7.3 C41.2 17.86,61.46 U7.2
  Top 0.406: U4.2 U4.1
  Top 0.61: C20.+ 59.69,48.9 U4.1 | C40.2 56.73,59.69 55.88,59.69 53.98,57.78 | v17.78,59.69 17.36,60.11 C41.2
  Top 1.016: v48.26,59.05 49.53,57.78 53.98,57.78 v53.98,53.34 | v57.78,50.8 58.42,50.16 C20.+
  Bottom 0.406: 61.05,50.16 C20.+ | F2.2 63.8,46.57 C21.1
  Bottom 1.016: F2.2 61.05,50.16 | v48.26,59.05 31.75,59.05 29.21,61.59 27.3,61.59 26.67,62.23 26.67,63.5 24.13,64.77 20.32,64.77 18.41,62.87 18.41,60.33 v17.78,59.69 13.97,59.69 11.43,57.15 8.89,57.15 JP5.2 | v53.98,53.34 56.52,50.8 v57.78,50.8
_1V1  (via drill 0.3)
  Top 0.254: C32.1 44.87,50.51 U5.45 40.64,50.51 | C30.1 44.87,46.51 U5.37 40.64,46.51 | 38.58,52.07 35.08,52.07 U5.60 35.08,55.24 34.29,55.24 | 38.58,52.07 U5.53 38.58,55.73 v38.73,55.88 | 40.64,46.51 40.64,50.51 | 38.58,52.07 39.08,52.07 40.64,50.51 | 37.08,44.45 U5.25 37.08,41.66 38.73,40.01 C28.1 | 37.08,44.45 39.37,44.45 40.64,45.72 40.64,46.51 | 37.08,44.45 36.83,44.45 36.83,45.09 34.08,45.09 U5.19 34.08,40.43 33.02,39.37 32.17,39.37 C26.1 | U5.63 33.58,55.24 34.29,55.24 | v34.29,55.88 34.29,55.24
  Top 0.406: R14.1 31.11,38.1 31.96,38.95 C26.1
  Bottom 0.254: v38.73,55.88 38.73,54.83 C34.1 | v34.29,55.88 34.29,53.98 C39.1 C44.1
_3V3  (via drill 0.3)
  Top 0.254: C33.1 44.87,52.01 U5.48 40.7,52.01 v40.64,52.07 | v40.64,44.45 40.01,44.45 40.01,42.53 U5.31 | U5.2 33.02,51.51 v33.02,52.07 | v34.92,44.45 34.58,44.45 U5.20 34.58,38.95 C29.1 34.51,38.73
  Top 0.305: U5.31 40.08,41.27 42.97,41.27 C31.1
  Top 0.406: 34.51,38.73 35.56,37.68 35.56,35.56 34.6,34.6 R13.1
  Bottom 0.254: v34.92,44.45 v40.64,44.45 v40.64,52.07 v33.02,52.07 33.02,51.02 C27.1
BAT1  (via drill 0.3)
  Top 0.254: U6.4 59.83,60.46 57.78,58.42 v57.15,58.42 | U5.4 27.59,50.51 v27.3,50.8
  Bottom 0.254: v27.3,50.8 27.3,53.34 31.75,57.78 56.52,57.78 v57.15,58.42
BAT2  (via drill 0.3)
  Top 0.254: U6.5 57.95,57.15 v57.15,57.15 | v28.57,51.44 28.79,51.01 U5.3
  Bottom 0.254: v57.15,57.15 32.38,57.15 28.57,53.34 v28.57,51.44
BAT3  (via drill 0.3)
  Top 0.254: U5.1 31.05,52.07 30.48,52.07 29.84,52.7 24.77,52.7 24.13,53.34 15.88,53.34 v14.61,54.61 | v14.61,58.42 17.78,58.42 18.41,58.42 19.05,59.05 19.05,59.69 19.05,60.33 19.18,60.46 U7.4
  Bottom 0.254: v14.61,54.61 v14.61,58.42
BAT4  (via drill 0.3)
  Top 0.254: U5.64 33.08,55.24 31.11,55.24 29.21,53.34 v26.67,53.34 | U7.5 20.11,58.62 v20.95,57.78
  Bottom 0.254: v20.95,57.78 25.4,53.34 v26.67,53.34
GND  (via drill 0.3, 3.2)  (1 unrouted)
  Top 0.254: U3.17 66.54,42.41 U3.21 | U3.21 U3.13 | U2.6 42.93,11.68 U2.17 | U2.3 42.93,11.43 U2.17 | U2.11 43.43,11.43 U2.17 | U3.21 U3.3 | U1.2.1 U1.2
  other vias: 66.04,12.06 70.48,13.97 34.29,3.81 77.47,10.16 66.04,15.24 69.85,10.79 54.61,3.81 55.88,5.71 54.61,1.27 49.53,3.81 82.55,8.89 54.61,8.89 77.47,13.34 54.61,12.7 80.01,13.97 74.3,13.34 74.93,10.16 31.11,7.62 56.52,13.34 63.5,13.34 45.09,9.53 41.27,15.24 41.27,9.53 43.18,6.99 77.47,16.51 57.15,9.53 41.27,13.34 69.85,3.81 51.44,15.24 54.61,15.24 58.42,15.88 52.7,7.62 58.42,13.34 43.18,16.51 73.03,7.62 74.93,3.81 82.55,13.97 64.14,16.51 51.44,12.7 69.85,1.27 74.93,1.27 49.53,1.27 80.01,8.89 46.99,13.97 35.56,49.53 36.83,49.53 38.1,49.53 38.1,48.26 38.1,46.99 36.83,46.99 36.83,48.26 35.56,48.26 35.56,46.99 48.26,51.44 47.62,47.62 76.83,62.87 6.99,62.87 33.02,36.2 36.2,62.87 43.18,60.96 59.69,55.88 38.1,33.66 80.01,27.94 80.01,69.85 3.81,69.85 3.81,27.94 41.91,31.11 51.44,31.11 55.88,32.38 65.41,36.83 70.48,37.47 60.96,33.02 72.39,33.02 52.7,45.72 45.09,55.88 47.62,62.87 50.8,55.88 13.34,57.15 7.62,58.42 3.81,56.52 41.91,69.85 3.81,3.81 80.01,3.81 80.01,19.05 3.81,19.05 41.91,3.81 41.91,19.05 35.56,38.73 36.83,40.64 50.8,46.99 65.41,59.05 69.85,59.05 39.37,60.96 27.94,57.15 34.29,1.27 29.21,1.27 29.21,3.81 27.94,8.89 20.32,6.35 20.32,10.16 27.94,11.43 35.56,12.06 35.56,9.53 37.47,5.08 13.97,3.81 13.97,1.27 8.89,1.27 8.89,3.17 10.79,7.62 57.15,20.95 60.96,8.26 35.56,19.68 26.67,20.95 17.78,20.95 10.16,20.95 26.67,15.88 19.05,13.34 7.62,8.89 43.18,11.43 21.59,61.59 21.59,60.33 62.23,61.59 62.23,60.33 7.62,13.97 48.9,8.26 49.53,11.43 48.26,16.51 21.59,1.27 62.23,1.27 21.59,72.39 62.23,72.39 54.61,24.77 44.45,24.77 35.56,24.77 33.66,30.48 35.56,31.75 62.87,41.91 26.67,54.61 18.41,57.15 50.8,20.95 35.56,27.94 44.45,27.94 53.98,27.94 68.58,22.23 21.59,25.4 8.89,41.91 16.51,8.89 60.96,12.7 60.33,12.06 60.96,11.43 61.59,12.06 59.69,12.7 62.23,12.7 60.96,10.16 70.48,34.92 64.77,31.75 73.03,41.27 57.78,27.94 72.39,10.16 68.58,8.26 21.59,58.42 24.77,59.69
  pour Top: 83.82,0 83.82,22.86 0,22.86 0,0
  pour Bottom: 83.82,0 83.82,22.86 0,22.86 0,0
  pour Bottom: 0,73.66 83.82,73.66 83.82,24.13 0,24.13
  pour Top: 0,73.66 83.82,73.66 83.82,24.13 0,24.13
GRST_N
  Top 0.254: U5.18 33.58,41.2 33.02,40.64 30.98,40.64 C19.1 26.16,38.87 JP4.2
N$1  (via drill 0.3)
  Top 0.254: U2.2 43.43,13.97 43.93,13.97 U2.1 | U2.15 45.72,11.68 45.72,12.18 U2.16 | C9.1 49.53,16.91 | C10.+ 51.44,16.83 | 47.41,17.14 C8.1 | L4.1 45.72,12.7
  Top 0.305: 43.93,13.97 v45.72,13.97 45.72,12.7 45.72,12.18 | C8.1 C9.1 | 49.53,16.91 C10.+ | 51.44,16.83 R3.1 | v46.35,17.14 47.41,17.14
  Bottom 0.305: v45.72,13.97 45.72,16.51 v46.35,17.14
N$2
  Bottom 0.61: F1.1 72.39,19.05 JP1.2
N$3
  Top 1.016: C12.2 X2.1
N$4
  Top 1.016: C13.2 X3.1
N$5
  Top 1.016: C14.2 X4.1
N$6
  Top 0.61: GT.2 73.7,11.74 L2.1
  Top 1.016: C4.1 69.85,12.7 arc29 L2.1 arc-17 X1.1
N$7
  Top 0.254: U2.4 42.43,13.97
  Top 1.016: 42.43,13.97 42.43,14.49 arc-90 43.18,15.24 49.53,15.24 arc-90 50.16,14.61 arc90 50.8,13.97 C11.2
N$8
  Top 0.254: L4.2 49.26,12.43 48.26,11.43 46.35,11.43 46.1,11.18 U2.14
N$9
  Top 1.016: C15.2 X5.1
N$10
  Top 0.305: U5.30 39.58,41.06 40.01,40.64 40.85,40.64 R19.2 45.51,38.73 C24.1 47.41,36.79 Q1.2
N$11
  Top 0.305: U5.29 39.08,40.72 R19.1 41.06,38.53 C25.1 42.76,34.25 Q1.1
N$12
  Top 0.254: U5.16 31.11,43.8 29.21,41.91 25.4,41.91 24.13,40.64 24.13,34.29 32.38,26.04 59.05,26.04 63.08,30.06 R5.2 R4.2
N$13
  Top 0.305: U5.32 43.6,42.53 R6.2
N$14  (via drill 0.3)
  Top 0.254: U5.9 26.42,48.01 v25.4,46.99
  Bottom 0.254: v25.4,46.99 25.4,45.3 R11.2
N$15
  Top 0.254: U5.8 25.65,48.51 24.77,47.62 R9.2
N$16  (via drill 0.3)
  Top 0.254: R8.2 v24.77,49.53 25.29,49.01 U5.7
  Bottom 0.254: R8.2 v24.77,49.53
N$17
  Top 0.61: R1.2 11.2,11.43 C5.+ 13.32,11.2 C6.1 19.47,11.85 29.84,22.23 51.44,22.23 53.34,20.32 R3.2 53.39,18.78 L3.1
N$18  (via drill 0.3)
  Top 0.254: U5.10 27.19,47.51 v26.67,46.99
  Bottom 0.254: v26.67,46.99 26.67,44.03 R12.2
N$19  (via drill 0.3)
  Top 0.254: v27.94,44.45 29.5,46.01 U5.13
  Bottom 0.254: R15.2 v27.94,44.45
N$20
  Bottom 0.254: PAD1.1 69.85,63.5 71.12,62.23 73.66,62.23 74.93,63.5 PAD3.1 77.89,64.14 78.53,63.5 | C42.2 C37.2 78.53,63.5 | 78.53,63.5 R24.1
N$22
  Top 0.254: R2.1 62.23,14.68 U1.1
  Top 1.016: C4.2 arc90 64.48,14.68 U1.1
N$23
  Top 0.61: JP2.2 R1.1
N$24
  Top 0.406: X7.VBUS R22.2 74.4,61.27 C35.2
N$25
  Bottom 0.254: PAD4.1 52.7,62.23 50.8,62.23 49.53,63.5 PAD2.1 C38.2 | C43.2 C38.2 | R25.1 C38.2
N$26
  Top 0.406: X8.VBUS R23.2 50.06,61.27 C36.2
N$27
  Bottom 0.254: C53.2 C51.2 | PAD5.1 31.11,62.23 33.02,62.23 34.29,63.5 PAD7.1 C51.2 | C51.2 R38.1
N$28
  Top 0.406: X9.VBUS R36.2 34.4,61.27 C47.2
N$29
  Bottom 0.254: PAD8.1 12.06,62.23 10.16,62.23 8.89,63.5 PAD6.1 C52.2 | C54.2 C52.2 | C52.2 R39.1
N$30
  Top 0.406: X10.VBUS R37.2 8.79,61.27 C48.2
N$31
  Top 0.254: U3.16 67.18,44.45 69.85,44.45 70.27,44.87 R17.1 73.23,44.87 R18.2
N$32
  Top 0.254: U3.15 71.12,43.21 R16.2
N$33
  Bottom 1.016: D2.A 67.74,53.34 68.58,53.34 70.56,52.63 J1.1
N$34
  Top 0.254: U6.7 66.96,60.46 R29.2
N$35
  Top 0.61: D1.C 67.75,17.35 C2.+ 69.81,17.55 L1.2 C1.2
N$36
  Top 0.254: U7.7 26.32,60.46 R30.2
N$37  (via drill 0.3)
  Top 0.254: U8.7 v14.61,46.35
  Bottom 0.254: v14.61,46.35 14.61,44.66 R31.2
N$38
  Top 0.254: U8.3 15.88,37.05 R28.2
N$39
  Top 0.254: U8.1 13.34,37.05 R27.2
N$40
  Top 0.254: U8.2 R26.2
N$41
  Top 0.61: L1.1 71.61,15.51 C3.2 71.75,15.61 L2.2
N$42  (via drill 0.3)
  Top 0.61: v64.14,20.32 65.61,20.32 D1.A
  Bottom 0.61: F1.2 65.41,19.05 v64.14,20.32
N$43
  Bottom 1.016: D2.C 67.31,48.8 F2.1
N$44  (via drill 0.3)
  Top 0.254: D3.1 67.31,32.82 v67.31,31.75 | X6.M3 74.92,34.28 v72.39,31.75
  Top 0.305: X6.M4 X6.M1 X6.M2 X6.M3
  Bottom 0.254: C17.1 v67.31,31.75 v72.39,31.75 | C18.1 C17.1 | C17.1 R7.2
N$51
  Top 0.254: C7.2 R2.2
OVR1  (via drill 0.3)
  Top 0.254: U6.10 63.5,62.16 v63.5,63.5 | v33.02,45.09 32.59,45.51 U5.14
  Bottom 0.254: v33.02,45.09 33.02,43.18 33.66,42.55 43.81,42.55 50.8,49.53 50.8,52.07 54.61,55.88 57.15,55.88 59.27,58 R32.1 63.5,59.27 v63.5,63.5
OVR2  (via drill 0.3)
  Top 0.254: U6.6 62.2,58.45 62.2,58.03 R34.1 60.54,58 v48.26,45.72 | v29.21,44.45 29.77,45.01 U5.15
  Bottom 0.254: v48.26,45.72 44.45,41.91 30.48,41.91 29.21,43.18 v29.21,44.45
OVR3  (via drill 0.3)
  Top 0.254: U7.10 23.07,63.3 v22.86,63.5 | U5.12 28.73,46.51 26.67,44.45 v22.23,44.45
  Bottom 0.254: v22.86,63.5 22.86,58.42 | 22.86,58.42 R33.1 | v22.23,44.45 20.32,46.35 20.32,52.7 17.14,55.88 17.14,57.78 17.78,58.42 18.41,58.42 19.05,59.05 22.23,59.05 22.86,58.42
OVR4  (via drill 0.3)
  Top 0.254: U7.6 23.5,59.96 23.5,59.05 25.82,59.05 R35.1 23.5,58.42 v22.86,57.78 | v22.23,45.72 27.3,45.72 28.57,46.99 31.09,46.99 U5.11 | v20.32,54.61 v25.4,54.61
  Bottom 0.254: v22.23,45.72 20.95,46.99 20.95,53.98 v20.32,54.61 | v25.4,54.61 22.86,57.15 v22.86,57.78
RF_OUT
  Top 0.254: L3.2 57.15,16.93 | 59.69,14.68 U1.3
  Top 0.305: 57.15,16.93 C7.1 59.69,14.68
  Top 1.016: C11.1 arc-90 56.17,14.68 U1.3
SCL
  Top 0.254: U5.6 26.05,49.51 24.77,50.8 19.05,50.8 17.78,49.53 17.78,46.99 18.41,46.35 18.41,43.18 17.78,42.55 16.51,42.55 15.88,43.18 U8.6 15.88,47.2 R20.2 13.97,49.11 13.97,51.44 13.34,52.07 12.7,52.07 12.06,51.44 12.06,47.62 11.43,46.99 JP3.3
SDA
  Top 0.254: U5.5 26.82,50.01 25.4,51.44 18.41,51.44 17.14,50.16 R21.2 | R21.2 17.14,47.84 U8.5 | R21.2 14.61,50.38 14.61,51.44 13.34,52.7 12.7,52.7 11.43,51.44 11.43,50.16 10.79,49.53 JP3.2
USB_1_N
  Top 0.254: U5.34 49.77,45.01 59.59,54.84 63.41,54.84 66.58,58.01 76.74,58.01 78.51,59.78 78.51,62.86 arc-90 79.35,63.7 arc90 79.73,64.08 79.73,64.73 arc90 79.35,65.11 arc-90 78.51,65.94 77.38,67.08 73.08,67.08 X7.D-
USB_1_P
  Top 0.254: U5.33 49.91,44.51 59.78,54.38 63.59,54.38 66.77,57.56 76.93,57.56 78.97,59.59 78.97,62.86 arc-90 79.35,63.24 arc90 80.19,64.08 80.19,64.73 arc90 79.35,65.56 arc-90 78.97,65.94 78.97,66.14 77.56,67.54 73.24,67.54 X7.D+
USB_1_VBUS
  Top 0.305: U6.9 64.64,61.46 64.77,61.59
  Top 0.406: R22.1 72.08,59.69 71.12,59.69 67.31,63.5 66.04,63.5 | 64.77,61.59 64.77,62.23 66.04,63.5 | 66.04,63.5 C45.+
  Bottom 0.406: C49.1 65.62,66.46 C45.+
USB_2_N  (via drill 0.61)
  Top 0.254: U5.42 47.42,49.01 49.3,50.9 49.3,54.52 45.49,58.33 45.49,64.86 48.57,67.94 v48.9,67.94
  Bottom 0.254: X8.D- 50.45,66.39 v48.9,67.94
USB_2_P
  Top 0.254: U5.41 47.56,48.51 49.76,50.7 49.76,54.7 45.95,58.52 45.95,64.67 47.95,66.67 50.16,66.67 51.88,68.39 X8.D+
USB_2_VBUS  (via drill 0.3)
  Top 0.305: U6.8 65.41,60.96
  Top 0.406: 58.42,63.5 60.96,63.5 62.23,64.77 63.5,64.77 v64.77,63.5 | 58.42,63.5 57.15,63.5 53.34,59.69 52.38,59.69 R23.1 | C55.+ 58.42,63.5 | 65.41,60.96 v66.04,61.59
  Bottom 0.406: C57.1 58.84,66.46 C55.+ | v66.04,61.59 66.04,62.23 v64.77,63.5
USB_3_N
  Top 0.254: U5.50 40.08,59.69 arc-90 41.02,60.62 arc90 41.45,61.06 41.45,62.12 arc90 41.02,62.56 arc-90 40.08,63.49 40.08,63.74 36.73,67.08 32.44,67.08 X9.D-
USB_3_P
  Top 0.254: U5.49 40.58,59.69 arc-90 41.02,60.12 arc90 41.95,61.06 41.95,62.12 arc90 41.02,63.06 arc-90 40.58,63.49 40.58,63.88 36.92,67.54 32.6,67.54 X9.D+
USB_3_VBUS
  Top 0.305: U7.9 24.13,61.46
  Top 0.406: R36.1 31.43,59.69 30.48,59.69 26.67,63.5 25.4,63.5 | 24.13,61.46 24.13,62.23 25.4,63.5 | 25.4,63.5 C46.+
  Bottom 0.406: C50.1 24.98,66.46 C46.+
USB_4_N  (via drill 0.3)
  Top 0.254: U5.57 36.6,53.98 36.6,55.78 35.47,56.92 30.57,56.92 29.3,55.65 12.7,55.65 arc90 12.32,55.27 arc-90 11.48,54.43 9.3,54.43 arc-90 8.47,55.27 arc90 8.09,55.65 6.25,55.65 3.58,58.1 3.58,64.86 6.66,67.94 v8.26,67.94
  Bottom 0.254: X10.D- 9.81,66.39 v8.26,67.94
USB_4_P
  Top 0.254: U5.56 37.06,53.98 37.06,55.98 35.66,57.38 30.39,57.38 29.11,56.11 12.7,56.11 arc90 11.86,55.27 arc-90 11.48,54.89 9.3,54.89 arc-90 8.92,55.27 arc90 8.09,56.11 6.45,56.11 4.04,58.74 4.04,64.67 6.04,66.67 9.53,66.67 11.24,68.39 X10.D+
USB_4_VBUS  (via drill 0.3)
  Top 0.305: U7.8 24.77,60.96
  Top 0.406: 17.78,63.5 20.32,63.5 21.59,64.77 22.86,64.77 v24.13,63.5 | 17.78,63.5 16.51,63.5 12.7,59.69 11.74,59.69 R37.1 | C56.+ 17.78,63.5 | 24.77,60.96 v25.4,61.59
  Bottom 0.406: C58.1 18.2,66.46 C56.+ | v25.4,61.59 25.4,62.23 v24.13,63.5
USB_UP_N  (via drill 0.3)
  Top 0.254: U5.22 35.58,40.94 37.06,39.47 37.06,30.57 38.2,29.44 53.34,29.44 arc90 53.72,29.82 53.72,30.5 arc-90 54.56,31.34 56.93,31.34 arc-90 57.76,30.5 57.76,29.82 arc90 58.15,29.44 59.59,29.44 v65.41,35.25 | D3.3 70.37,36.27 | 70.37,36.27 72.11,37.87 72.39,37.87 72.45,37.94 X6.2 | v70.48,36.2 70.41,36.27 70.37,36.27
  Bottom 0.254: v65.41,35.25 66.35,36.2 v70.48,36.2
USB_UP_P
  Top 0.254: U5.21 35.08,40.8 36.6,39.27 36.6,30.39 38.01,28.98 53.34,28.98 arc90 54.18,29.82 54.18,30.5 arc-90 54.56,30.88 54.84,30.88 arc-90 55.22,30.5 55.22,27.46 arc90 55.6,27.08 55.88,27.08 arc90 56.26,27.46 56.26,30.5 arc-90 56.65,30.88 56.93,30.88 arc-90 57.31,30.5 57.31,29.82 arc90 58.15,28.98 59.78,28.98 64.93,34.13 66.22,34.13 D3.4 70.19,38.33 72.39,38.33 72.8,38.73 X6.3
USB_UP_VBUS
  Top 0.254: X6.1 74.17,36.2 73.03,36.2 69.85,33.02 D3.2 69.23,30.09 C16.+ 67.5,28.36 R4.1
VCC  (via drill 0.3)
  Top 0.305: U3.1 63.64,43.18 62.23,43.18 62.23,45.72 | 65.04,45.72 U3.20 | U3.18 66.04,45.72 | U3.19 65.54,45.72
  Top 0.406: R14.2 v31.11,31.75 | v60.96,45.72 62.23,45.72 65.04,45.72 65.54,45.72 66.04,45.72 66.04,46.57 | 66.04,46.57 R17.2 | C23.+ 66.04,46.57
  Bottom 0.406: v31.11,31.75 31.11,31.11 33.02,29.21 44.45,29.21 v60.96,45.72
VOUT1
  Top 0.254: U2.13 45.72,10.68
  Top 0.406: 45.72,10.68 arc-45 46.35,10.16
  Top 1.016: 46.35,10.16 54.61,10.16 arc-90 55.88,8.89 arc90 58.42,6.35 C12.1
VOUT2
  Top 0.254: U2.12 43.93,8.89
  Top 0.406: 44.45,8.26 arc-32 43.93,8.89
  Top 1.016: C13.1 44.45,8.26
VOUT3
  Top 0.254: U2.10 42.93,8.89
  Top 0.406: 42.55,8.26 arc35 42.93,8.89
  Top 1.016: C14.1 42.55,8.26
VOUT4
  Top 0.254: U2.8 40.64,10.68
  Top 1.016: C15.1 22.86,8.89 arc-21 40.64,10.68

### Text on the board
Top: +5V IN EXT | +5V OUT | OK3ZB / USB 2.0 Hub / for CATV Active Splitter / TUSB4041I | USB UP | LNA EXT PWR | OK3ZB / CATV Active Splitter / ADA4304-4, HMC599 | +5V IN
_tNames: C56 | C46 | C55 | C45 | X10 | X9 | X8 | X7 | U7 | U6 | C48 | C41 | R30 | C36 | C40 | R36 | C47 | R22 | C35 | R29 | R37 | R35 | R23 | R34 | J1 | JP5 | JP3 | C20 | U5 | C23 | C33 | R21 | C32 | R10 | R20 | R9 | C30 | R18 | U3 | R17 | R6 | C22 | U8 | C31 | U4 | C19 | C26 | C29 | C28 | R16 | R19 | JP4 | C25 | C24 | I2C/SMBus | Q1 | X6 | R27 | R26 | R28 | R14 | R13 | C16 | R5 | R4 | L3 | C1 | C8 | C9 | C10 | R3 | C7 | R2 | D1 | JP1 | X1 | L4 | C11 | C2 | L2 | JP2 | R1 | C4 | L1 | C3 | GT | U2 | C6 | U1 | C5 | C15 | C14 | C13 | C12 | X5 | X4 | X3 | X2
_bNames: C58 | C50 | C57 | C49 | C54 | C53 | C43 | C42 | C52 | C37 | R39 | R24 | C38 | C51 | R38 | R25 | R32 | R33 | C44 | C39 | C34 | D2 | C27 | F2 | R8 | R31 | R11 | R12 | C21 | R15 | I2C/SMBus | R7 | C17 | C18 | F1